# EAGLE design Lab05a (EAGLE 9.6.2)
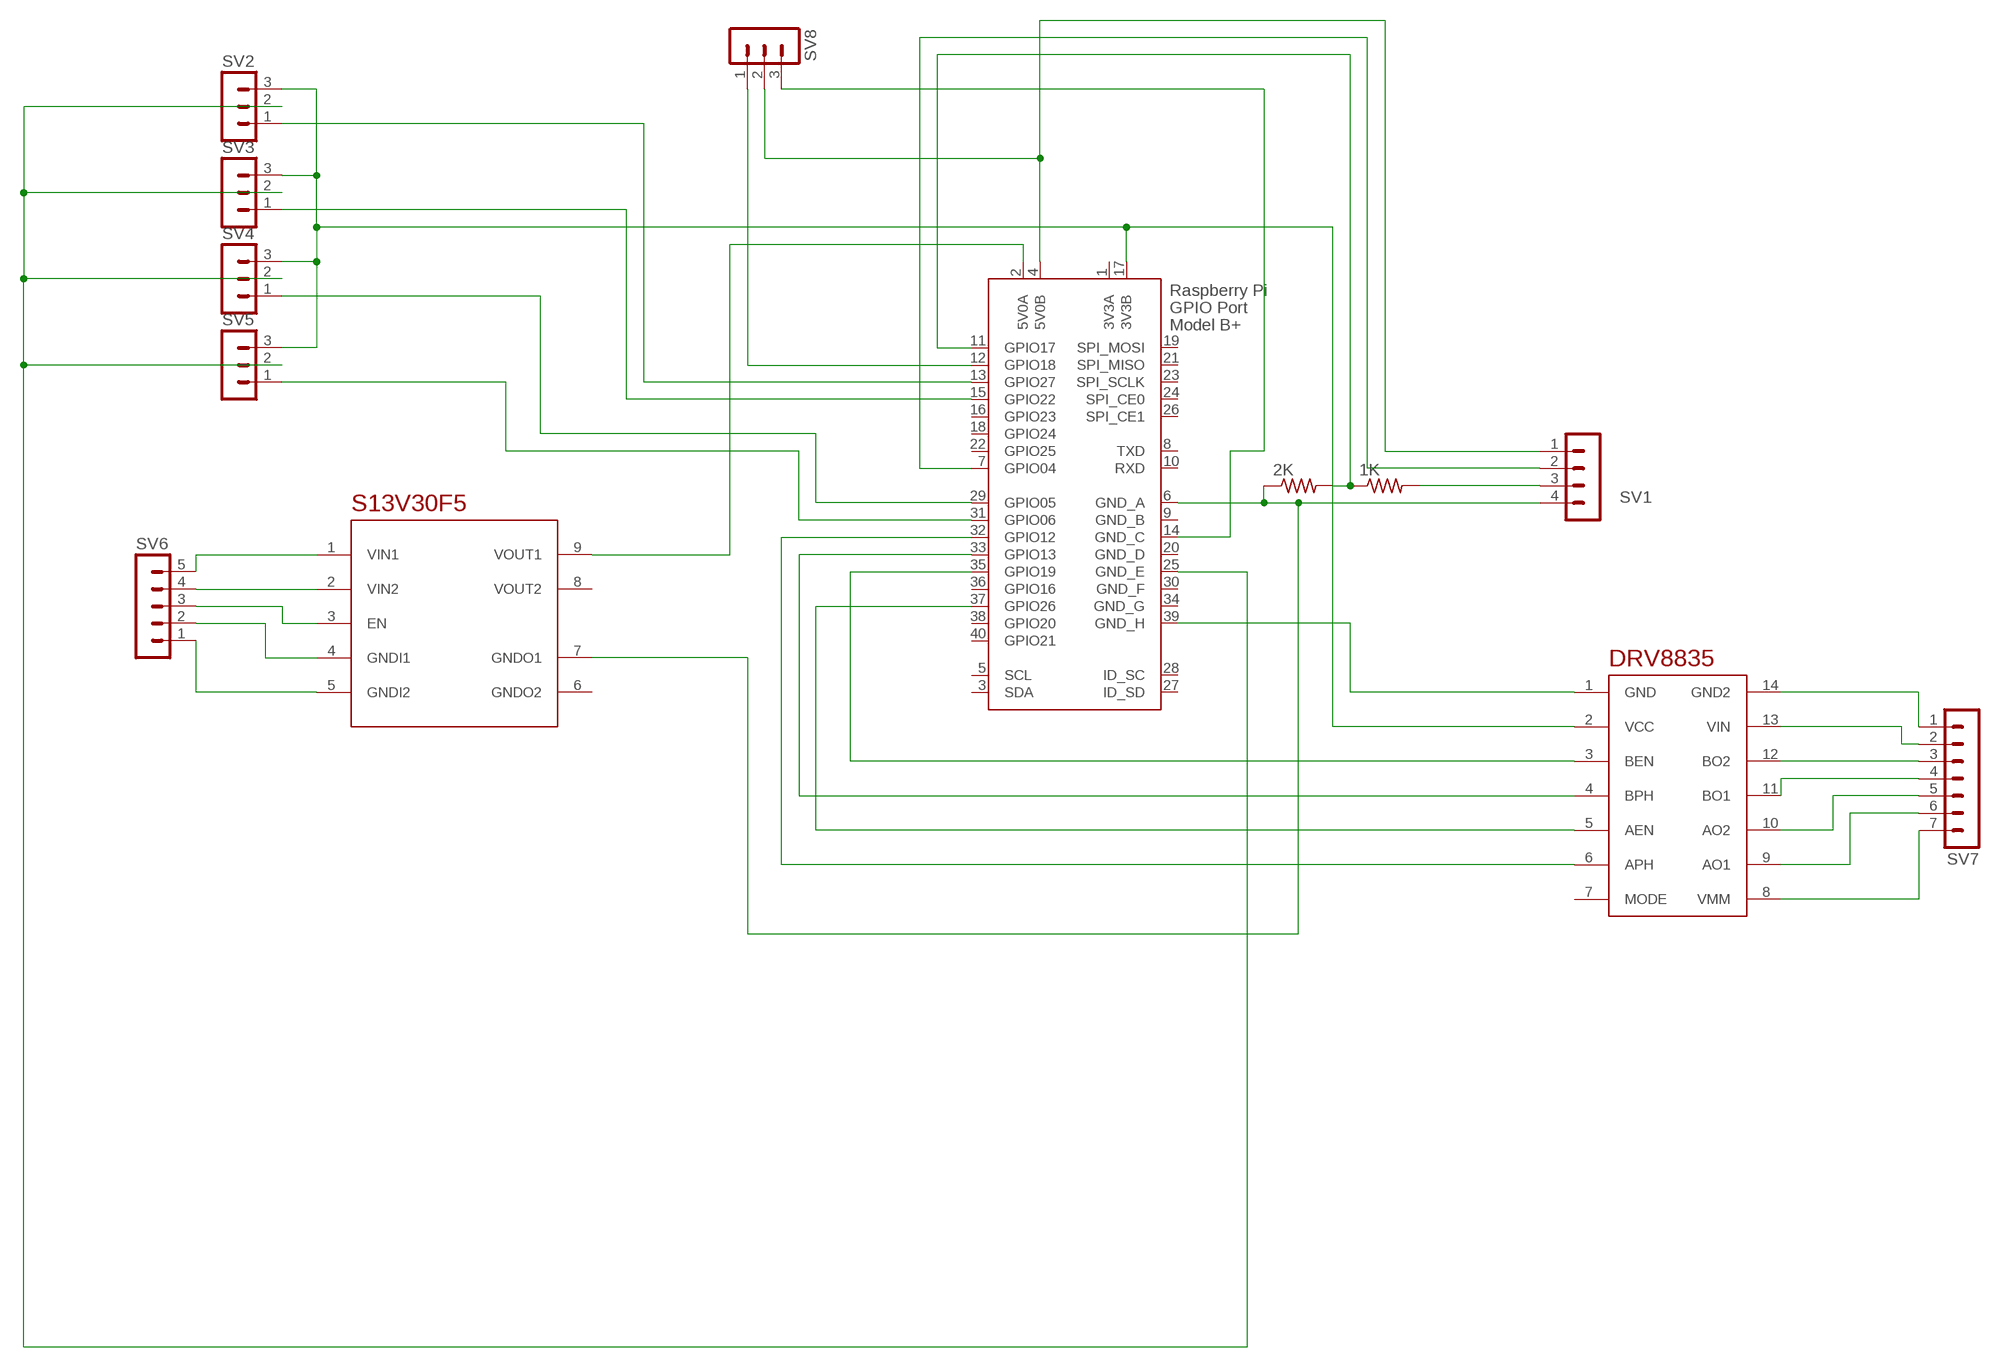
[diagram p0: schematic, sheet 1]

## Parts
1K  R-US_0207/10  [0207/10]
2K  R-US_0207/10  [0207/10]
SV1  MA04-1  [MA04-1]
SV2  MA03-1  [MA03-1]
SV3  MA03-1  [MA03-1]
SV4  MA03-1  [MA03-1]
SV5  MA03-1  [MA03-1]
SV6  MA05-1  [MA05-1]
SV7  MA07-1  [MA07-1]
SV8  MA03-1  [MA03-1]
U$1  DRV8835  [DRV8835]
U$2  S13V20F5  [S13V20F5]
X1  RASPI_BOARD_B+#_E4  [RASPI_BOARD_B+_EDGES_4DRILL]

## Nets
3V: SV2.3 SV3.3 SV4.3 SV5.3 U$1.2(VCC) X1.17(3V3B)
GND: SV2.2 SV3.2 SV4.2 SV5.2 X1.25(GND_E)
N$1: SV1.1 SV8.2 X1.4(5V0B)
N$2: SV1.2 X1.7(GPIO04)
N$3: 1K.2 SV1.3
N$4: 1K.1 2K.2 X1.11(GPIO17)
N$5: 2K.1 SV1.4 U$2.7(GNDO1) X1.6(GND_A)
N$6: SV7.1 U$1.14(GND2)
N$7: SV2.1 X1.13(GPIO27)
N$8: SV3.1 X1.15(GPIO22)
N$9: SV4.1 X1.29(GPIO05)
N$10: SV5.1 X1.31(GPIO06)
N$11: SV7.2 U$1.13(VIN)
N$12: U$1.4(BPH) X1.33(GPIO13)
N$13: U$1.6(APH) X1.32(GPIO12)
N$14: U$1.5(AEN) X1.37(GPIO26)
N$15: U$1.3(BEN) X1.35(GPIO19)
N$16: U$1.1(GND) X1.39(GND_H)
N$17: U$2.9(VOUT1) X1.2(5V0A)
N$18: SV7.3 U$1.12(BO2)
N$19: SV7.4 U$1.11(BO1)
N$20: SV7.5 U$1.10(AO2)
N$21: SV7.6 U$1.9(AO1)
N$22: SV7.7 U$1.8(VMM)
N$23: SV6.5 U$2.1(VIN1)
N$24: SV6.4 U$2.2(VIN2)
N$25: SV6.3 U$2.3(EN)
N$26: SV6.2 U$2.4(GNDI1)
N$27: SV6.1 U$2.5(GNDI2)
N$28: SV8.1 X1.12(GPIO18)
N$29: SV8.3 X1.14(GND_C)
Unconnected: U$1.7(MODE) U$2.6(GNDO2) U$2.8(VOUT2) X1.3(SDA) X1.5(SCL) X1.8(TXD) X1.10(RXD) X1.16(GPIO23) X1.18(GPIO24) X1.19(SPI_MOSI) X1.21(SPI_MISO) X1.22(GPIO25) X1.23(SPI_SCLK) X1.24(SPI_CE0) X1.26(SPI_CE1) X1.27(ID_SD) X1.28(ID_SC) X1.36(GPIO16) X1.38(GPIO20) X1.40(GPIO21)

## Power pins joined to a net without a drawn wire
3V3A: X1.1(3V3A)
GND_B: X1.9(GND_B)
GND_D: X1.20(GND_D)
GND_F: X1.30(GND_F)
GND_G: X1.34(GND_G)

## Library data of the parts
1K 2K = rcl:R-US_: RESISTOR, American symbol; SPICEPREFIX: R
SV1 = con-lstb:MA04-1: PIN HEADER; OC_FARNELL: unknown; OC_NEWARK: unknown
SV2-SV5 SV8 = con-lstb:MA03-1: PIN HEADER; OC_FARNELL: unknown; OC_NEWARK: unknown
SV6 = con-lstb:MA05-1: PIN HEADER; OC_FARNELL: unknown; OC_NEWARK: unknown
SV7 = con-lstb:MA07-1: PIN HEADER; OC_FARNELL: unknown; OC_NEWARK: unknown
U$1 = mt280_21:DRV8835
U$2 = mt280_21:S13V20F5
X1 = raspberrypi_bastelstube_v13:RASPI_BOARD_B+#: Raspberry Pi GPIO connector with markings for the outer dimensions of the Raspberry Pi board model B+ with different sets of drill holes or mounting pads All pins connected

## Board
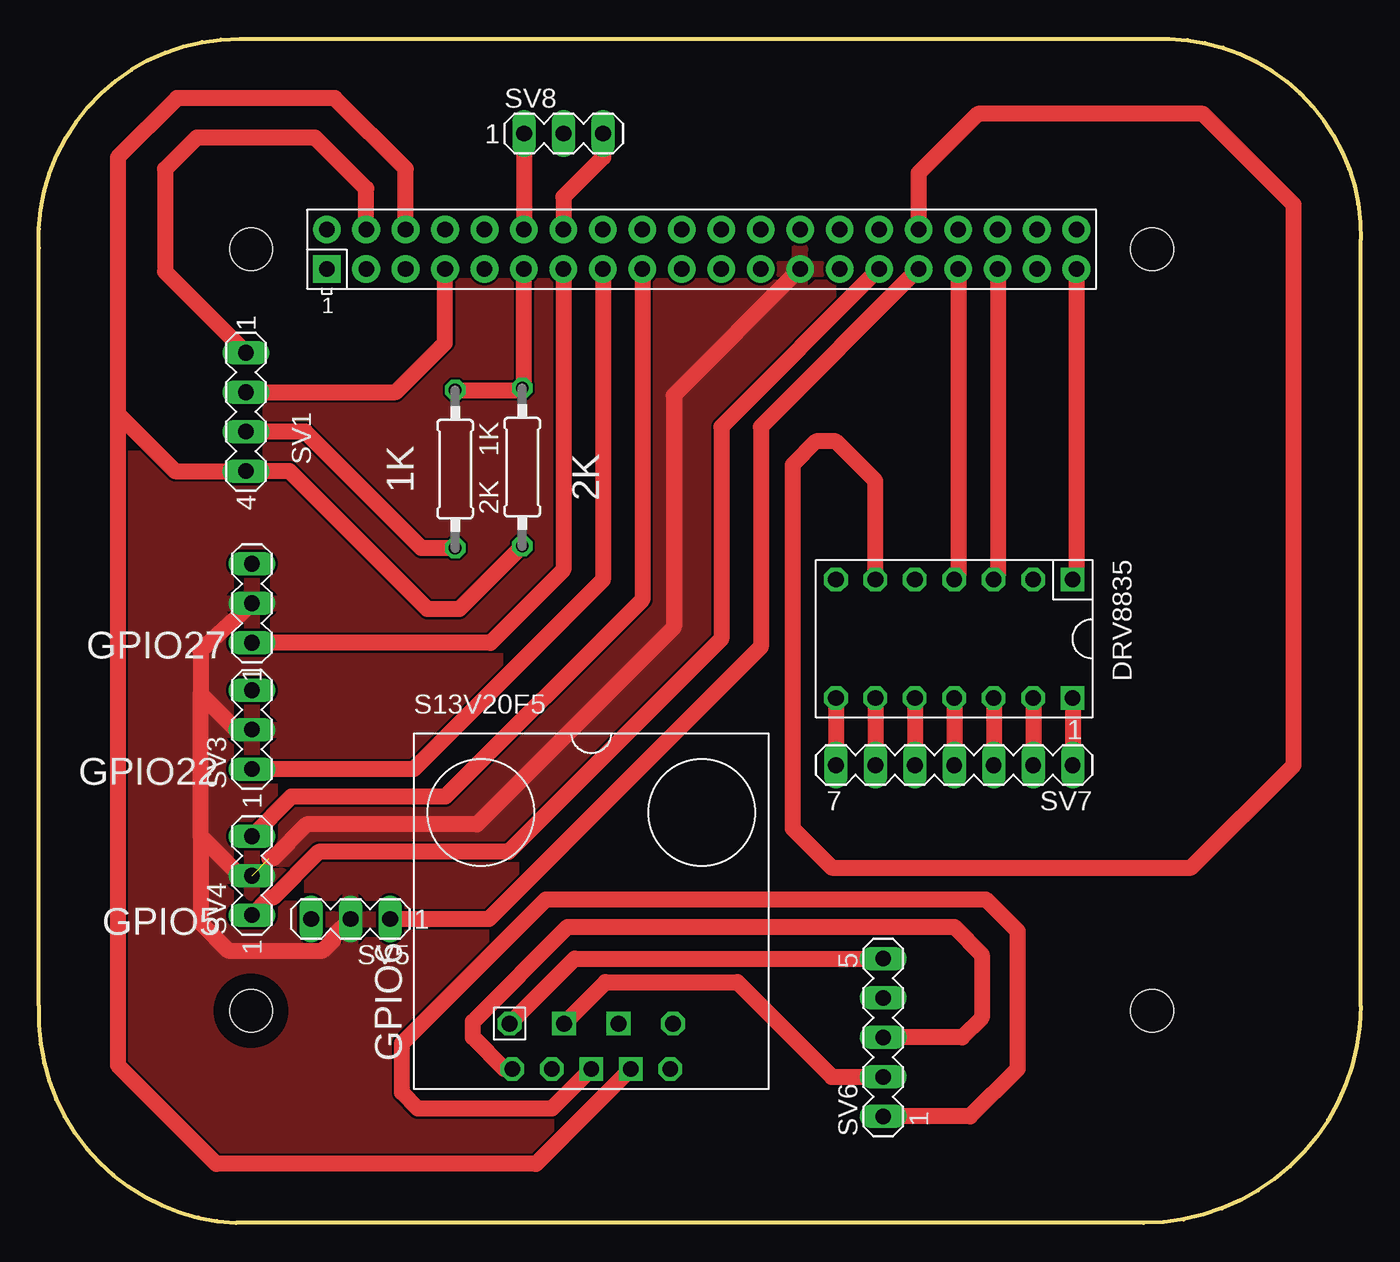
[diagram p1: board, top side]
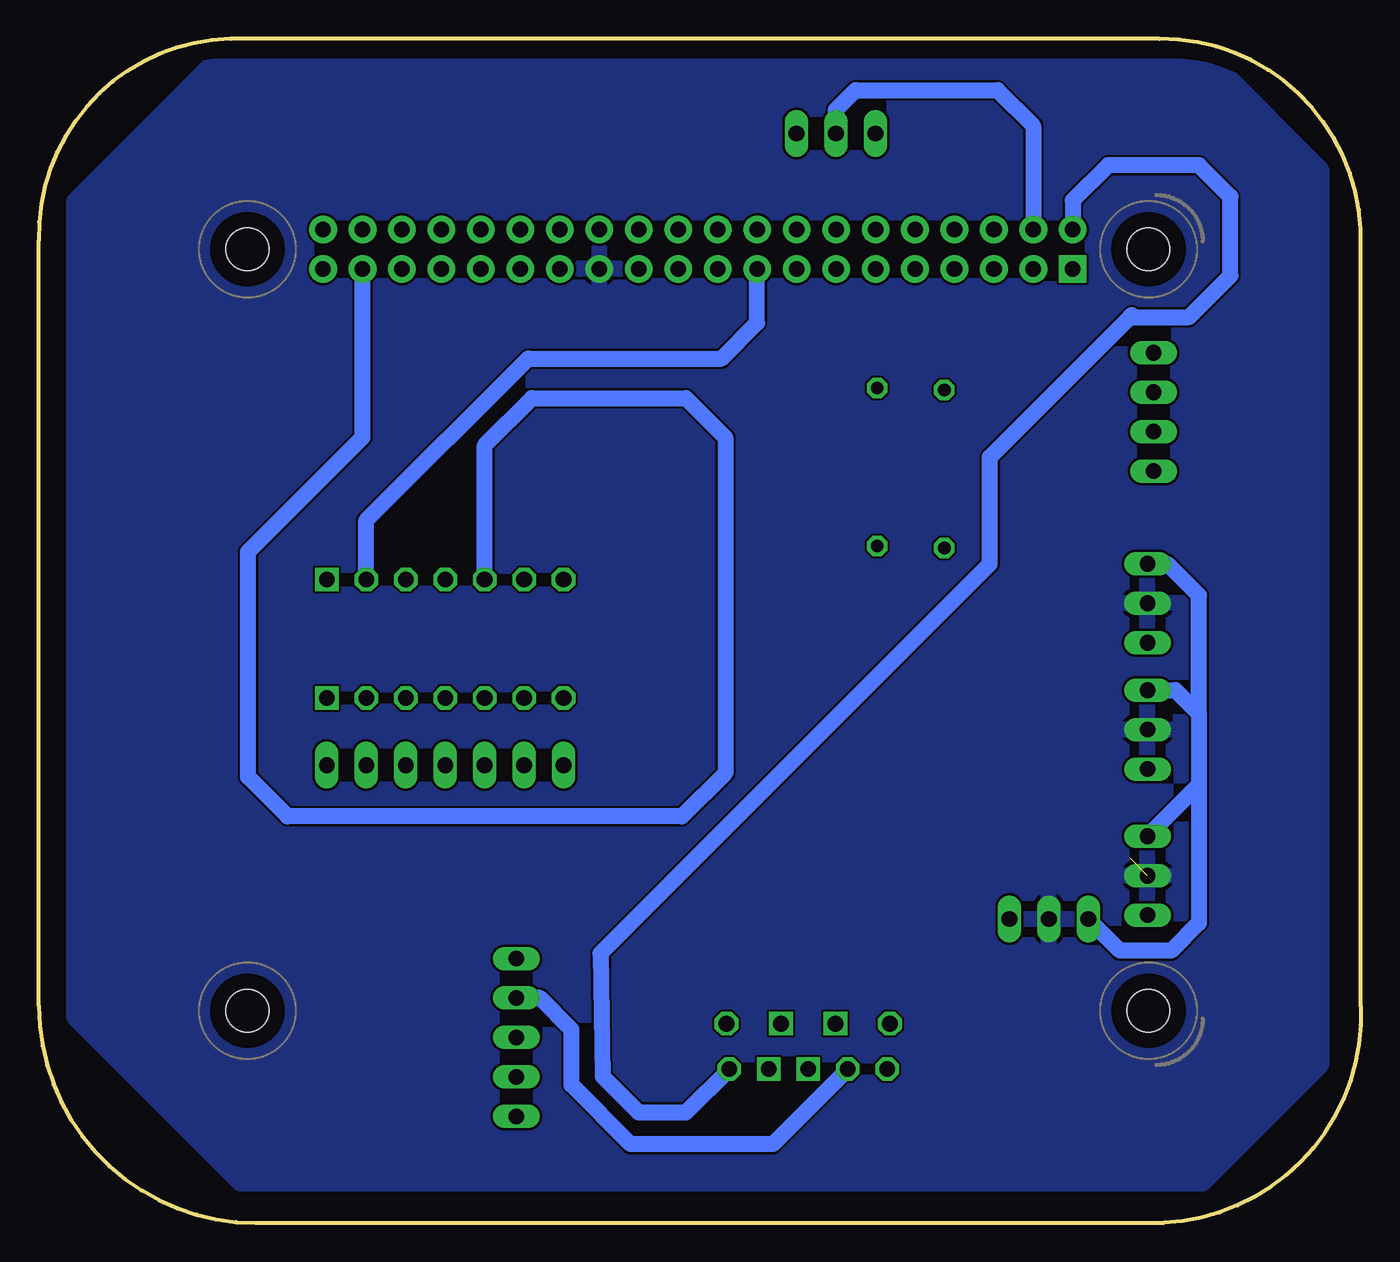
[diagram p2: board, bottom side, seen from below]

Size 85.09 x 76.2 mm. Coordinates in mm from the lower left corner, seen from the top.
Outline: 0,13.97 arc90 12.7,0 71.12,0 arc90 85.09,13.97 85.09,63.25 arc90 72.77,76.2 12.96,76.2 arc93 0,62.74 0,13.97
Copper layers (1*16): Top 0.035mm / dielectric 1.5mm / Bottom 0.035mm
Design rules "default": minimum track width 6mil, minimum drill 0.35mm, track to track 6mil, track to pad 6mil, pad to pad 6mil, via to via 6mil, smd to smd 6mil, copper to edge 40mil, drill to drill 6mil, minimum pad ring 10mil, minimum via ring 8mil, stop-mask expansion 4mil, vias tented up to drill 0mil, thermal gap 10mil

### Footprints (pad centres in the part's own frame; a part is rotated, then mirrored left to right if it is on the bottom)
0207/10 = drill 0.813 octagon: 1 -5.08,0; 2 5.08,0
MA04-1 = drill 1.016 long: 1 -3.81,0; 2 -1.27,0; 3 1.27,0; 4 3.81,0
MA03-1 = drill 1.016 long: 1 -2.54,0; 2 0,0; 3 2.54,0
MA05-1 = drill 1.016 long: 1 -5.08,0; 2 -2.54,0; 3 0,0; 4 2.54,0; 5 5.08,0
MA07-1 = drill 1.016 long: 1 -7.62,0; 2 -5.08,0; 3 -2.54,0; 4 0,0; 5 2.54,0; 6 5.08,0; 7 7.62,0
DRV8835 = drill 1.016 square: 1 -3.81,7.62; 14 3.81,7.62 | drill 1.016 octagon: 2 -3.81,5.08; 3 -3.81,2.54; 4 -3.81,0; 5 -3.81,-2.54; 6 -3.81,-5.08; 7 -3.81,-7.62; 8 3.81,-7.62; 9 3.81,-5.08; 10 3.81,-2.54; 11 3.81,0; 12 3.81,2.54; 13 3.81,5.08
S13V20F5 = drill 1.016 octagon: 1 -5.258,-7.239; 2 -2.54,-10.16; 3 -5.08,-10.16; 8 5.258,-7.239; 9 5.08,-10.16 | drill 1.016 square: 4 -1.753,-7.239; 5 0,-10.16; 6 1.753,-7.239; 7 2.54,-10.16
RASPI_BOARD_B+_EDGES_4DRILL = drill 1 pad 1.778 square: 1 8.37,51.23 | drill 1 pad 1.778: 2 8.37,53.77; 3 10.91,51.23; 4 10.91,53.77; 5 13.45,51.23; 6 13.45,53.77; 7 15.99,51.23; 8 15.99,53.77; 9 18.53,51.23; 10 18.53,53.77; 11 21.07,51.23; 12 21.07,53.77; 13 23.61,51.23; 14 23.61,53.77; 15 26.15,51.23; 16 26.15,53.77; 17 28.69,51.23; 18 28.69,53.77; 19 31.23,51.23; 20 31.23,53.77; 21 33.77,51.23; 22 33.77,53.77; 23 36.31,51.23; 24 36.31,53.77; 25 38.85,51.23; 26 38.85,53.77; 27 41.39,51.23; 28 41.39,53.77; 29 43.93,51.23; 30 43.93,53.77; 31 46.47,51.23; 32 46.47,53.77; 33 49.01,51.23; 34 49.01,53.77; 35 51.55,51.23; 36 51.55,53.77; 37 54.09,51.23; 38 54.09,53.77; 39 56.63,51.23; 40 56.63,53.77 | hole 2.75: 3.5,3.5; 3.5,52.5; 61.5,3.5; 61.5,52.5

### Placement (x,y rotation side)
1K  26.8,48.51 270 top
2K  31.12,48.64 90 top
SV1  13.34,52.2 270 top
SV2  13.72,39.88 90 top
SV3  13.72,31.75 90 top
SV4  13.72,22.35 90 top
SV5  20.07,19.56 180 top
SV6  54.36,11.94 90 top
SV7  58.93,29.46 180 top
SV8  33.78,70.1 0 top
U$1  58.93,37.59 270 top
U$2  35.56,20.07 0 top
X1  10.16,10.16 0 top

### Tracks (layer width: path | path; a pad name or v marks a point on that pad's centre or on a via)
3V
  Top 1.016: X1.17 38.85,40.12 26.16,27.43 16.26,27.43 SV4.3
  Bottom 1.016: U$1.2 64.01,45.21 53.6,55.63 41.15,55.63 38.85,57.92 X1.17 | SV4.3 10.42,28.19 | SV2.3 12.45,42.42 10.42,40.39 10.42,32.77 | 10.42,32.77 10.42,28.19 | SV3.3 11.94,34.29 10.42,32.77 | 10.42,28.19 10.42,19.3 12.19,17.53 15.5,17.53 SV5.3
GND  (1 unrouted)
  Top 0.254: 10.67,33.78 10.67,34.04 | SV3.2 12.7,31.75
  Top 1.016: X1.25 40.88,53.26 40.88,38.34 28.2,25.65 17.25,25.65 15.07,23.47 14.84,23.47 | 12.96,22.35 10.42,24.89 | SV2.2 10.42,36.85 10.42,34.04 | 10.42,24.89 10.42,34.04 | 12.7,31.75 10.67,33.78 10.42,34.04 | 10.42,24.89 10.42,19.3 12.19,17.53 18.27,17.53 18.95,18.21 18.95,18.44 SV5.2
  Bottom 1.016: SV4.2 12.7,22.35
  pour Bottom: 12.45,74.42 9.15,74.42 2.54,67.82 2.54,10.16 10.16,2.54 72.14,2.54 82.81,13.21 82.81,65.79 75.19,73.41 74.17,74.42
  pour Top: 19.31,74.42 8.89,74.42 2.29,67.82 2.29,10.16 9.65,2.79 10.42,2.03 56.64,2.03 71.63,2.03 82.3,12.7 82.81,13.21 82.81,66.04 74.42,74.42
N$1
  Top 1.016: X1.4 21.07,66.56 17.78,69.85 10.16,69.85 8.13,67.82 8.13,61.21 SV1.1
  Bottom 1.016: SV8.2 33.78,71.63 32.51,72.9 23.37,72.9 21.07,70.6 X1.4
N$2
  Top 1.016: X1.7 26.15,56.64 22.98,53.47 SV1.2
N$3
  Top 1.016: 1K.2 24.64,43.43 17.15,50.93 SV1.3
N$4
  Top 1.016: 1K.1 30.99,53.59 2K.2 31.23,53.84 X1.11
N$5
  Top 1.016: 2K.1 27.05,39.5 25.02,39.5 16.13,48.39 SV1.4 8.76,48.39 5.08,52.07 | X1.6 23.61,67.83 19.05,72.39 8.89,72.39 5.08,68.58 5.08,52.07 | 5.08,52.07 5.08,10.16 11.43,3.81 32.01,3.81 U$2.7
  Bottom 1.016: 23.96,63.93 X1.6
N$6
  Top 1.016: U$1.14 SV7.1
N$7
  Top 1.016: X1.13 33.77,42.04 29.07,37.34 SV2.1
N$8
  Top 1.016: X1.15 36.31,41.39 24.13,29.21 SV3.1
N$9
  Top 1.016: X1.29 43.93,51.23 43.93,37.58 30.23,23.88 18.02,23.88 15.07,20.93 14.84,20.93 SV4.1
N$10
  Top 1.016: X1.31 46.47,51.23 46.47,37.07 28.96,19.56 SV5.1
N$11
  Top 1.016: U$1.13 SV7.2
N$12
  Top 1.016: U$1.4 59.18,41.66 59.18,61.38 X1.33
N$13
  Top 1.016: U$1.6 53.85,47.75 51.31,50.29 50.04,50.29 48.52,48.77 48.52,25.4 51.06,22.86 74.17,22.86 80.77,29.46 80.77,65.53 74.93,71.37 60.45,71.37 56.63,67.55 X1.32
N$14
  Bottom 1.016: X1.37 64.25,50.56 71.63,43.18 71.63,28.7 69.09,26.16 43.69,26.16 40.9,28.96 40.9,50.55 43.44,53.09 53.34,53.09 56.39,50.04 U$1.5
N$15
  Top 1.016: U$1.3 61.72,41.66 61.72,61.38 X1.35
N$16
  Top 1.016: X1.39 66.79,41.64 U$1.1
N$17
  Bottom 1.016: U$2.9 43.44,7.11 46.48,7.11 48.8,9.43 48.95,17.35 23.88,42.42 23.88,49.28 14.86,58.29 | 14.86,58.29 14.73,58.42 | 14.86,58.29 11.05,58.29 8.38,60.96 8.38,66.04 10.42,68.07 16.26,68.07 18.53,65.8 X1.2
N$18
  Top 1.016: U$1.12 SV7.3
N$19
  Top 1.016: U$1.11 SV7.4
N$20
  Top 1.016: U$1.10 SV7.5
N$21
  Top 1.016: U$1.9 SV7.6
N$22
  Top 1.016: U$1.8 SV7.7
N$23
  Top 1.016: U$2.1 34.49,17.02 SV6.5
N$24
  Bottom 1.016: U$2.2 37.85,5.08 46.99,5.08 50.8,8.89 50.8,12.45 52.83,14.48 SV6.4
N$25
  Top 1.016: U$2.3 29.97,9.91 27.94,11.94 27.94,12.95 34.04,19.05 58.93,19.05 60.71,17.27 60.71,13.21 59.44,11.94 SV6.3
N$26
  Top 1.016: U$2.4 36.48,15.49 44.96,15.49 51.06,9.4 SV6.2
N$27
  Top 1.016: U$2.5 33.02,7.37 24.39,7.37 23.37,8.38 23.37,11.56 32.64,20.83 60.96,20.83 62.99,18.8 62.99,9.91 59.95,6.86 SV6.1
N$28
  Top 1.016: SV8.1 31.24,63.94 X1.12
N$29
  Top 1.016: SV8.3 36.32,68.58 33.77,66.03 X1.14

### Text on the board
tPlace: 2K | 1K | GPIO27 | GPIO22 | GPIO5 | GPIO6